# Altium schematic sheet FMC_HPC_TO_LPC_BREAKOUT_ROW_HPC2.SchDoc: High-pin count (HPC) row F, J, and K pass-through
size A4; Date: 12.12.2024; DrawnBy: PFH; Engineer: PFH; DocumentNumber: 1; Revision: A; SheetNumber: 3; SheetTotal: 3; Projekt: FMC HPC to LPC breakout module (single width); Website: www.fmchub.com; ProjectName: FMC_Single_LPC_BREAKOUT
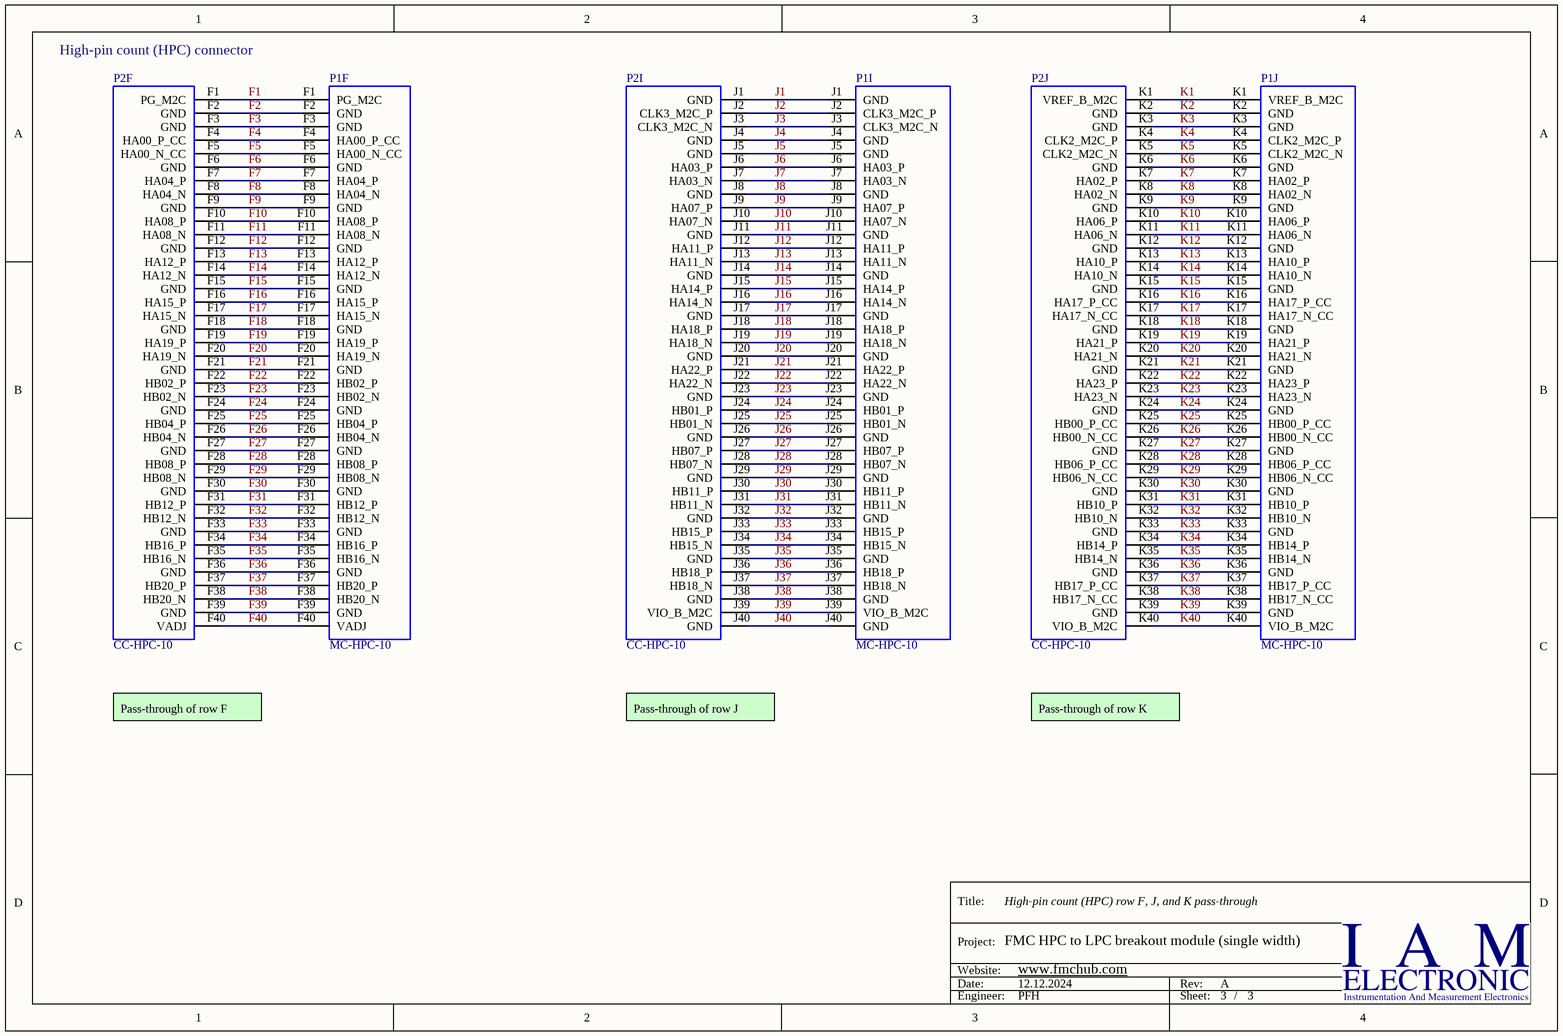
[diagram p0: FMC_HPC_TO_LPC_BREAKOUT_ROW_HPC2.SchDoc]

## Parts
P1  MC-HPC-10  [ASP-134488-01]  (parts F,I,J of 10)
P2  CC-HPC-10  [ASP-134486-01]  (parts F,I,J of 10)

## Nets
F1: P1.F1(PG_M2C) P2.F1(PG_M2C)
F2: P1.F2(GND) P2.F2(GND)
F3: P1.F3(GND) P2.F3(GND)
F4: P1.F4(HA00_P_CC) P2.F4(HA00_P_CC)
F5: P1.F5(HA00_N_CC) P2.F5(HA00_N_CC)
F6: P1.F6(GND) P2.F6(GND)
F7: P1.F7(HA04_P) P2.F7(HA04_P)
F8: P1.F8(HA04_N) P2.F8(HA04_N)
F9: P1.F9(GND) P2.F9(GND)
F10: P1.F10(HA08_P) P2.F10(HA08_P)
F11: P1.F11(HA08_N) P2.F11(HA08_N)
F12: P1.F12(GND) P2.F12(GND)
F13: P1.F13(HA12_P) P2.F13(HA12_P)
F14: P1.F14(HA12_N) P2.F14(HA12_N)
F15: P1.F15(GND) P2.F15(GND)
F16: P1.F16(HA15_P) P2.F16(HA15_P)
F17: P1.F17(HA15_N) P2.F17(HA15_N)
F18: P1.F18(GND) P2.F18(GND)
F19: P1.F19(HA19_P) P2.F19(HA19_P)
F20: P1.F20(HA19_N) P2.F20(HA19_N)
F21: P1.F21(GND) P2.F21(GND)
F22: P1.F22(HB02_P) P2.F22(HB02_P)
F23: P1.F23(HB02_N) P2.F23(HB02_N)
F24: P1.F24(GND) P2.F24(GND)
F25: P1.F25(HB04_P) P2.F25(HB04_P)
F26: P1.F26(HB04_N) P2.F26(HB04_N)
F27: P1.F27(GND) P2.F27(GND)
F28: P1.F28(HB08_P) P2.F28(HB08_P)
F29: P1.F29(HB08_N) P2.F29(HB08_N)
F30: P1.F30(GND) P2.F30(GND)
F31: P1.F31(HB12_P) P2.F31(HB12_P)
F32: P1.F32(HB12_N) P2.F32(HB12_N)
F33: P1.F33(GND) P2.F33(GND)
F34: P1.F34(HB16_P) P2.F34(HB16_P)
F35: P1.F35(HB16_N) P2.F35(HB16_N)
F36: P1.F36(GND) P2.F36(GND)
F37: P1.F37(HB20_P) P2.F37(HB20_P)
F38: P1.F38(HB20_N) P2.F38(HB20_N)
F39: P1.F39(GND) P2.F39(GND)
F40: P1.F40(VADJ) P2.F40(VADJ)
J1: P1.J1(GND) P2.J1(GND)
J2: P1.J2(CLK3_M2C_P) P2.J2(CLK3_M2C_P)
J3: P1.J3(CLK3_M2C_N) P2.J3(CLK3_M2C_N)
J4: P1.J4(GND) P2.J4(GND)
J5: P1.J5(GND) P2.J5(GND)
J6: P1.J6(HA03_P) P2.J6(HA03_P)
J7: P1.J7(HA03_N) P2.J7(HA03_N)
J8: P1.J8(GND) P2.J8(GND)
J9: P1.J9(HA07_P) P2.J9(HA07_P)
J10: P1.J10(HA07_N) P2.J10(HA07_N)
J11: P1.J11(GND) P2.J11(GND)
J12: P1.J12(HA11_P) P2.J12(HA11_P)
J13: P1.J13(HA11_N) P2.J13(HA11_N)
J14: P1.J14(GND) P2.J14(GND)
J15: P1.J15(HA14_P) P2.J15(HA14_P)
J16: P1.J16(HA14_N) P2.J16(HA14_N)
J17: P1.J17(GND) P2.J17(GND)
J18: P1.J18(HA18_P) P2.J18(HA18_P)
J19: P1.J19(HA18_N) P2.J19(HA18_N)
J20: P1.J20(GND) P2.J20(GND)
J21: P1.J21(HA22_P) P2.J21(HA22_P)
J22: P1.J22(HA22_N) P2.J22(HA22_N)
J23: P1.J23(GND) P2.J23(GND)
J24: P1.J24(HB01_P) P2.J24(HB01_P)
J25: P1.J25(HB01_N) P2.J25(HB01_N)
J26: P1.J26(GND) P2.J26(GND)
J27: P1.J27(HB07_P) P2.J27(HB07_P)
J28: P1.J28(HB07_N) P2.J28(HB07_N)
J29: P1.J29(GND) P2.J29(GND)
J30: P1.J30(HB11_P) P2.J30(HB11_P)
J31: P1.J31(HB11_N) P2.J31(HB11_N)
J32: P1.J32(GND) P2.J32(GND)
J33: P1.J33(HB15_P) P2.J33(HB15_P)
J34: P1.J34(HB15_N) P2.J34(HB15_N)
J35: P1.J35(GND) P2.J35(GND)
J36: P1.J36(HB18_P) P2.J36(HB18_P)
J37: P1.J37(HB18_N) P2.J37(HB18_N)
J38: P1.J38(GND) P2.J38(GND)
J39: P1.J39(VIO_B_M2C) P2.J39(VIO_B_M2C)
J40: P1.J40(GND) P2.J40(GND)
K1: P1.K1(VREF_B_M2C) P2.K1(VREF_B_M2C)
K2: P1.K2(GND) P2.K2(GND)
K3: P1.K3(GND) P2.K3(GND)
K4: P1.K4(CLK2_M2C_P) P2.K4(CLK2_M2C_P)
K5: P1.K5(CLK2_M2C_N) P2.K5(CLK2_M2C_N)
K6: P1.K6(GND) P2.K6(GND)
K7: P1.K7(HA02_P) P2.K7(HA02_P)
K8: P1.K8(HA02_N) P2.K8(HA02_N)
K9: P1.K9(GND) P2.K9(GND)
K10: P1.K10(HA06_P) P2.K10(HA06_P)
K11: P1.K11(HA06_N) P2.K11(HA06_N)
K12: P1.K12(GND) P2.K12(GND)
K13: P1.K13(HA10_P) P2.K13(HA10_P)
K14: P1.K14(HA10_N) P2.K14(HA10_N)
K15: P1.K15(GND) P2.K15(GND)
K16: P1.K16(HA17_P_CC) P2.K16(HA17_P_CC)
K17: P1.K17(HA17_N_CC) P2.K17(HA17_N_CC)
K18: P1.K18(GND) P2.K18(GND)
K19: P1.K19(HA21_P) P2.K19(HA21_P)
K20: P1.K20(HA21_N) P2.K20(HA21_N)
K21: P1.K21(GND) P2.K21(GND)
K22: P1.K22(HA23_P) P2.K22(HA23_P)
K23: P1.K23(HA23_N) P2.K23(HA23_N)
K24: P1.K24(GND) P2.K24(GND)
K25: P1.K25(HB00_P_CC) P2.K25(HB00_P_CC)
K26: P1.K26(HB00_N_CC) P2.K26(HB00_N_CC)
K27: P1.K27(GND) P2.K27(GND)
K28: P1.K28(HB06_P_CC) P2.K28(HB06_P_CC)
K29: P1.K29(HB06_N_CC) P2.K29(HB06_N_CC)
K30: P1.K30(GND) P2.K30(GND)
K31: P1.K31(HB10_P) P2.K31(HB10_P)
K32: P1.K32(HB10_N) P2.K32(HB10_N)
K33: P1.K33(GND) P2.K33(GND)
K34: P1.K34(HB14_P) P2.K34(HB14_P)
K35: P1.K35(HB14_N) P2.K35(HB14_N)
K36: P1.K36(GND) P2.K36(GND)
K37: P1.K37(HB17_P_CC) P2.K37(HB17_P_CC)
K38: P1.K38(HB17_N_CC) P2.K38(HB17_N_CC)
K39: P1.K39(GND) P2.K39(GND)
K40: P1.K40(VIO_B_M2C) P2.K40(VIO_B_M2C)

## Notes on the sheet
- (near P2) High-pin count (HPC) connector
- Pass-through of row F
- Pass-through of row J
- Pass-through of row K
- Title:
- Project:
- Date:
- Website:
- Rev:
- Engineer:
- Sheet:
- /

## Library data of the parts
P1 = MC-HPC-10: MC-HPC-10, FMC High-pin count connector, lead free, 400 I/Os, male, 10 mm mated stack height; Manufacturer: Samtec; Manufacturer Ref: SEAM-40-03.5-S-10-2-A-K-TR-VITA57.0; Pitch: 1.27 mm; Mated Stack Height: 10 mm; Solder Type: Lead-Free; Number I/O: 400; PartName: ASP-134488-01; Part: ASP-134488-01; Vita PartNumber: MC-HPC-10; Pin Count: High; Gender: male; Supplier 1: Digi-Key; Supplier Part Number 1: SAM8730-ND
P2 = CC-HPC-10: CC-HPC-10, FMC High-pin count connector, lead free, 400 I/Os, female, 10 mm mated stack height; Manufacturer: Samtec; Manufacturer Ref: SEAF-40-06.5-10-A; Pitch: 1.27 mm; Mated Stack Height: 10 mm; Solder Type: Lead-Free; Number I/O: 400; PartName: ASP-134486-01; Part: ASP-134486-01; Vita PartNumber: CC-HPC-10; Pin Count: High; Gender: female; Supplier 1: Digi-Key; Supplier Part Number 1: SAM8728-ND